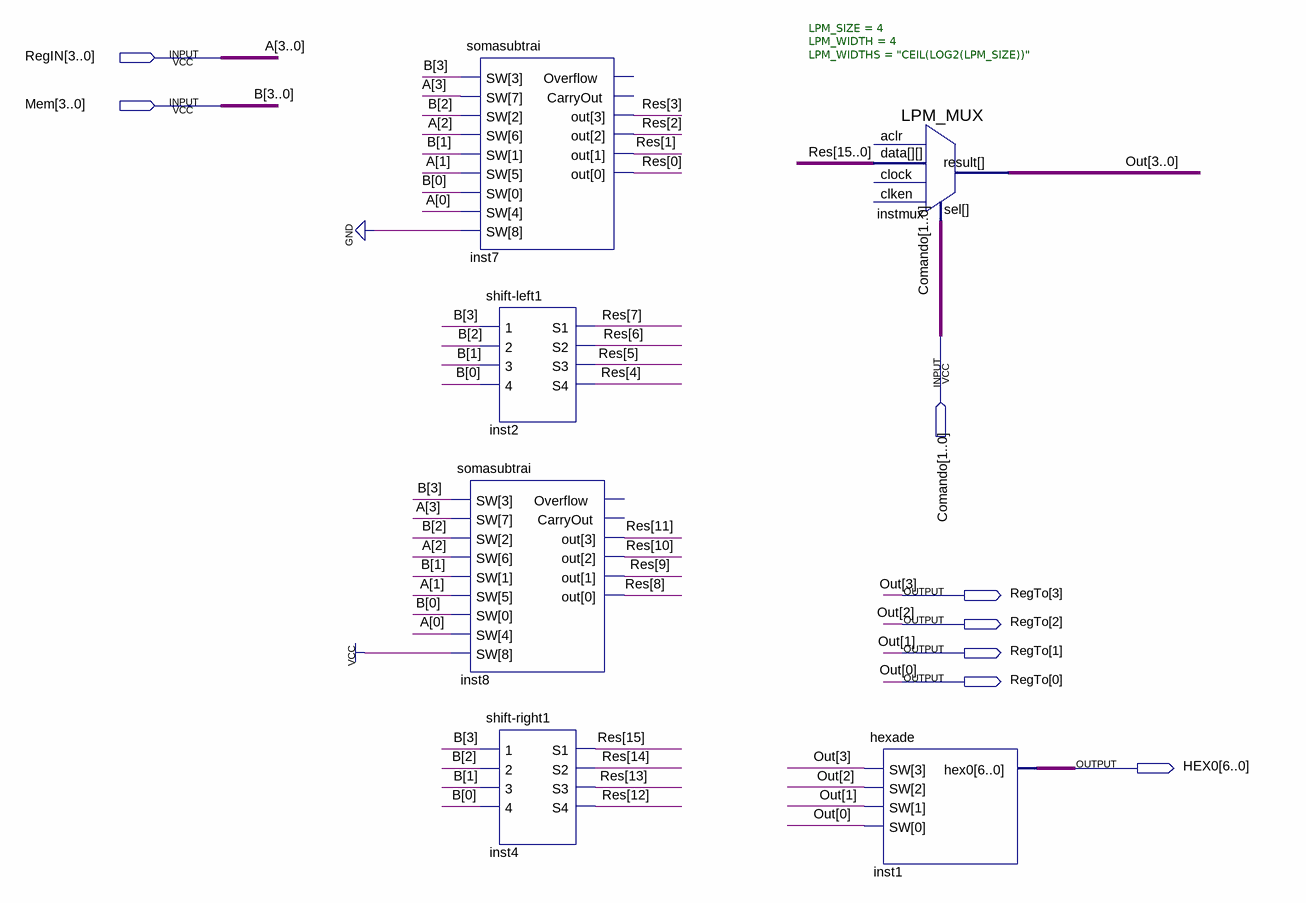
[diagram p0: schematic sheet]
// Quartus schematic Ulala.bdf as structural Verilog: 6 symbols, 8 pins
module Ulala (
  input  [3:0] RegIN,
  input  [3:0] Mem,
  input  [1:0] Comando,
  output [3:0] RegTo,
  output [6:0] HEX0
);

  wire [15:0] Res;

  somasubtrai inst7 (.SW({1'b0, RegIN, Mem}), .out(Res[3:0]));  // open: Overflow, CarryOut
  \shift-left1  inst2 (
    .\1 (Mem[3]), .\2 (Mem[2]), .\3 (Mem[1]), .\4 (Mem[0]), .S1(Res[7]), .S2(Res[6]), .S3(Res[5]), .S4(Res[4]));
  somasubtrai inst8 (.SW({1'b1, RegIN, Mem}), .out(Res[11:8]));  // open: Overflow, CarryOut
  \shift-right1  inst4 (
    .\1 (Mem[3]), .\2 (Mem[2]), .\3 (Mem[1]), .\4 (Mem[0]), .S1(Res[15]), .S2(Res[14]), .S3(Res[13]),
    .S4(Res[12]));
  LPM_MUX #(.LPM_SIZE(4), .LPM_WIDTH(4), .LPM_WIDTHS("CEIL(LOG2(LPM_SIZE))")) instmux (
    .data(Res), .sel(Comando), .result(RegTo));  // open: clock, aclr, clken
  hexade inst1 (.SW(RegTo), .hex0(HEX0));

  // Other names for the same wires on the sheet: A[3:0] = RegIN; B[3:0] = Mem; Out[3:0] = RegTo
endmodule
